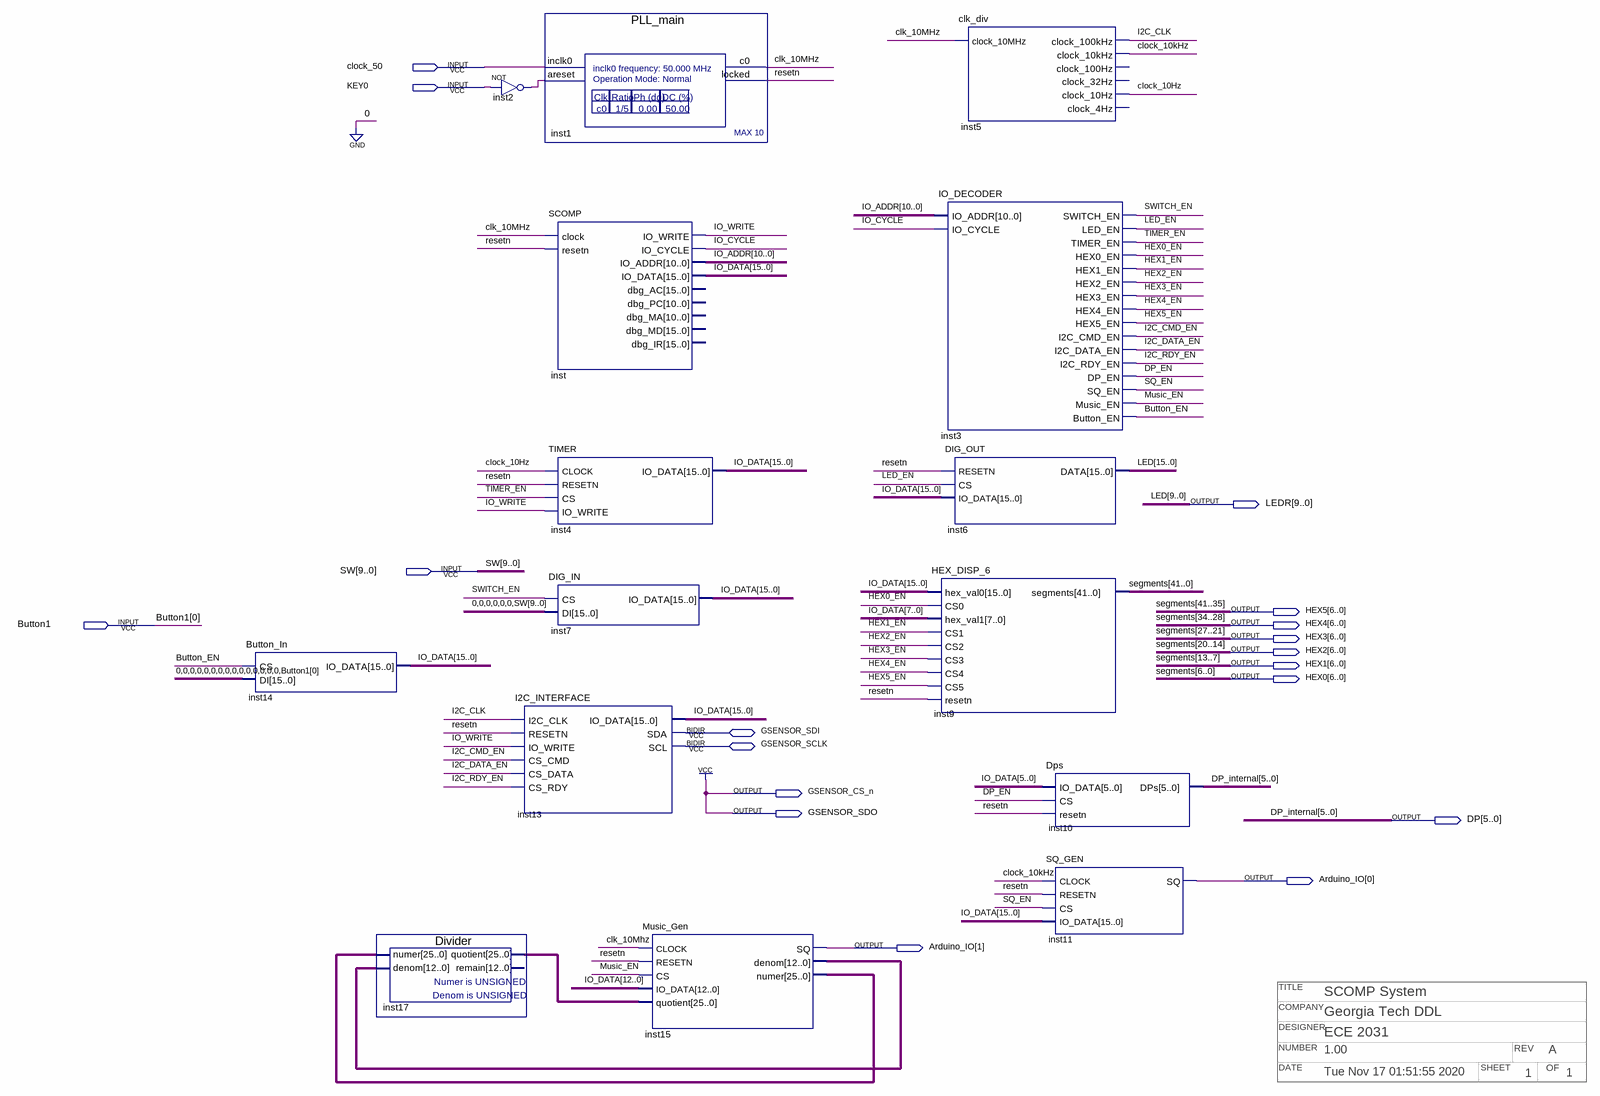
[diagram p0: schematic sheet]
// Quartus schematic SCOMP_System.bdf as structural Verilog: 15 symbols, 18 pins
// Title block: COMPANY: Georgia Tech DDL; DATE: Tue Nov 17 01:51:55 2020; DESIGNER: ECE 2031; NUMBER: 1.00; OF: 1; REV: A; SHEET: 1; TITLE: SCOMP System
module SCOMP_System (
  input  clock_50,
  input  KEY0,
  input  [9:0] SW,
  input  Button1,
  inout  GSENSOR_SDI,
  inout  GSENSOR_SCLK,
  output [9:0] LEDR,
  output [6:0] HEX5,
  output [6:0] HEX4,
  output [6:0] HEX3,
  output [6:0] HEX2,
  output [6:0] HEX1,
  output [6:0] HEX0,
  output GSENSOR_CS_n,
  output GSENSOR_SDO,
  output [5:0] DP,
  output [1:0] Arduino_IO
);

  wire Button_EN, clk_10MHz, clock_10Hz, clock_10kHz, DP_EN, HEX0_EN, HEX1_EN, HEX2_EN, HEX3_EN, HEX4_EN,
       HEX5_EN, I2C_CLK, I2C_CMD_EN, I2C_DATA_EN, I2C_RDY_EN, inst2_out, IO_CYCLE, IO_WRITE, LED_EN,
       Music_EN, resetn, SQ_EN, SWITCH_EN, TIMER_EN;
  wire [10:0] IO_ADDR;
  wire [12:0] inst15_denom;
  wire [15:0] IO_DATA;
  wire [15:10] LED;
  wire [25:0] inst15_numer, inst17_quotient;

  Button_In inst14 (.CS(Button_EN), .DI({{15{1'b0}}, Button1}), .IO_DATA(IO_DATA));
  Divider inst17 (.numer(inst15_numer), .denom(inst15_denom), .quotient(inst17_quotient));  // open: remain
  not inst2 (inst2_out, KEY0);
  PLL_main inst1 (.inclk0(clock_50), .areset(inst2_out), .c0(clk_10MHz), .locked(resetn));
  SCOMP inst (
    .clock(clk_10MHz), .resetn(resetn), .IO_WRITE(IO_WRITE), .IO_CYCLE(IO_CYCLE), .IO_ADDR(IO_ADDR),
    .IO_DATA(IO_DATA));  // open: dbg_AC, dbg_PC, dbg_MA, dbg_MD, dbg_IR
  TIMER inst4 (.CLOCK(clock_10Hz), .RESETN(resetn), .CS(TIMER_EN), .IO_WRITE(IO_WRITE), .IO_DATA(IO_DATA));
  DIG_IN inst7 (.CS(SWITCH_EN), .DI({{6{1'b0}}, SW}), .IO_DATA(IO_DATA));
  I2C_INTERFACE inst13 (
    .I2C_CLK(I2C_CLK), .RESETN(resetn), .IO_WRITE(IO_WRITE), .CS_CMD(I2C_CMD_EN), .CS_DATA(I2C_DATA_EN),
    .CS_RDY(I2C_RDY_EN), .IO_DATA(IO_DATA), .SDA(GSENSOR_SDI), .SCL(GSENSOR_SCLK));
  Music_Gen inst15 (
    .CLOCK(clk_10MHz), .RESETN(resetn), .CS(Music_EN), .IO_DATA(IO_DATA[12:0]), .quotient(inst17_quotient),
    .SQ(Arduino_IO[1]), .denom(inst15_denom), .numer(inst15_numer));
  clk_div inst5 (
    .clock_10MHz(clk_10MHz), .clock_100kHz(I2C_CLK), .clock_10kHz(clock_10kHz), .clock_10Hz(clock_10Hz));  // open: clock_100Hz, clock_32Hz, clock_4Hz
  IO_DECODER inst3 (
    .IO_ADDR(IO_ADDR), .IO_CYCLE(IO_CYCLE), .SWITCH_EN(SWITCH_EN), .LED_EN(LED_EN), .TIMER_EN(TIMER_EN),
    .HEX0_EN(HEX0_EN), .HEX1_EN(HEX1_EN), .HEX2_EN(HEX2_EN), .HEX3_EN(HEX3_EN), .HEX4_EN(HEX4_EN),
    .HEX5_EN(HEX5_EN), .I2C_CMD_EN(I2C_CMD_EN), .I2C_DATA_EN(I2C_DATA_EN), .I2C_RDY_EN(I2C_RDY_EN),
    .DP_EN(DP_EN), .SQ_EN(SQ_EN), .Music_EN(Music_EN), .Button_EN(Button_EN));
  DIG_OUT inst6 (.RESETN(resetn), .CS(LED_EN), .IO_DATA(IO_DATA), .DATA({LED, LEDR}));
  HEX_DISP_6 inst9 (
    .hex_val0(IO_DATA), .CS0(HEX0_EN), .hex_val1(IO_DATA[7:0]), .CS1(HEX1_EN), .CS2(HEX2_EN), .CS3(HEX3_EN),
    .CS4(HEX4_EN), .CS5(HEX5_EN), .resetn(resetn), .segments({HEX5, HEX4, HEX3, HEX2, HEX1, HEX0}));
  Dps inst10 (.IO_DATA(IO_DATA[5:0]), .CS(DP_EN), .resetn(resetn), .DPs(DP));
  SQ_GEN inst11 (.CLOCK(clock_10kHz), .RESETN(resetn), .CS(SQ_EN), .IO_DATA(IO_DATA), .SQ(Arduino_IO[0]));

  assign GSENSOR_CS_n = 1'b1;
  assign GSENSOR_SDO = 1'b1;

  // Other names for the same wires on the sheet: Button1[0] = Button1; DP_internal[5:0] = DP; LED[9:0] = LEDR;
  //   segments[41:0] = {HEX5, HEX4, HEX3, HEX2, HEX1, HEX0}
endmodule
